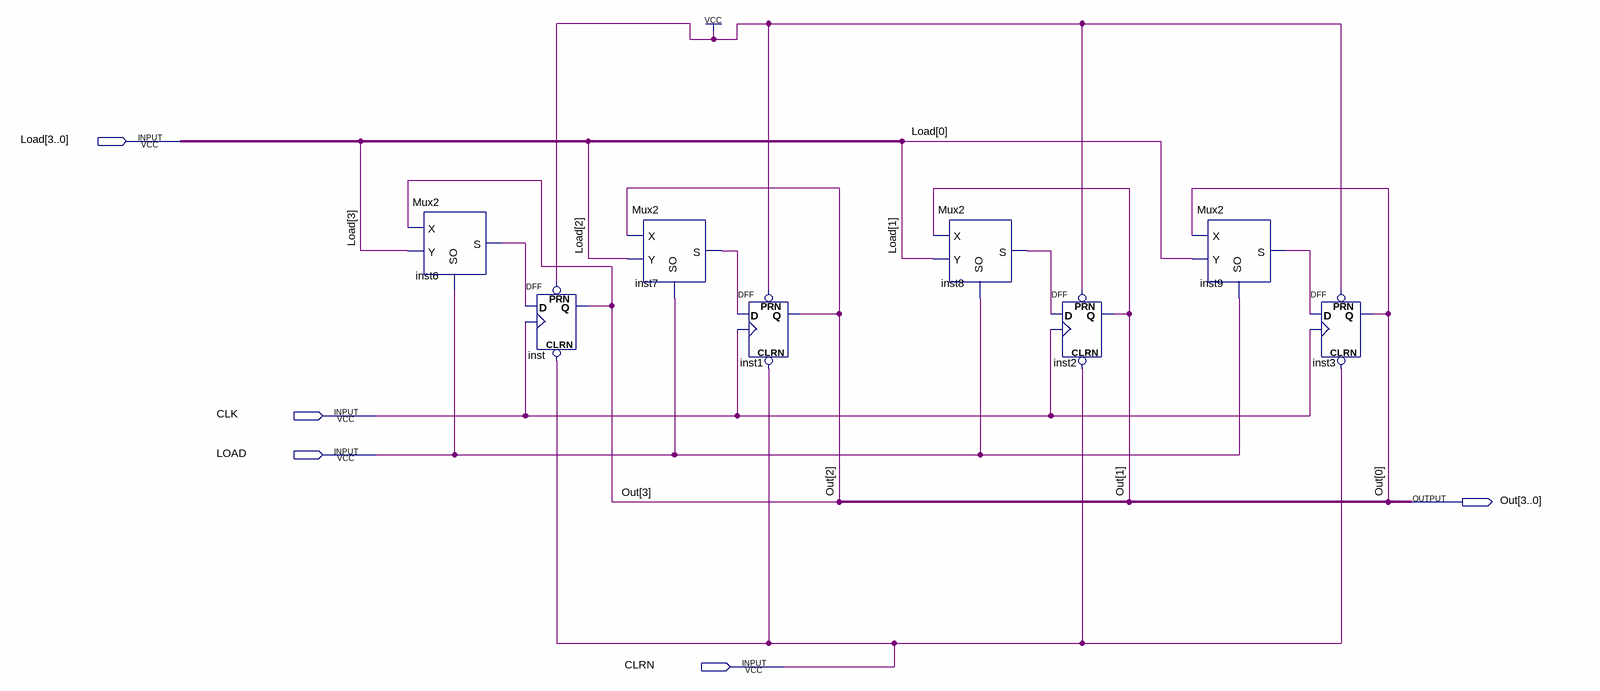
[diagram p0: schematic sheet]
// Quartus schematic Registrador.bdf as structural Verilog: 8 symbols, 5 pins
module Registrador (
  input  [3:0] LOAD,
  input  CLK,
  input  LOAD_1bit,
  input  CLRN,
  output [3:0] Out
);

  wire inst6_s, inst7_s, inst8_s, inst9_s;

  Mux2 inst6 (.X(Out[3]), .SO(LOAD_1bit), .Y(LOAD[3]), .S(inst6_s));
  DFF inst (.CLRN(CLRN), .CLK(CLK), .D(inst6_s), .PRN(1'b1), .Q(Out[3]));
  Mux2 inst7 (.X(Out[2]), .SO(LOAD_1bit), .Y(LOAD[2]), .S(inst7_s));
  DFF inst1 (.CLRN(CLRN), .CLK(CLK), .D(inst7_s), .PRN(1'b1), .Q(Out[2]));
  Mux2 inst8 (.X(Out[1]), .SO(LOAD_1bit), .Y(LOAD[1]), .S(inst8_s));
  DFF inst2 (.CLRN(CLRN), .CLK(CLK), .D(inst8_s), .PRN(1'b1), .Q(Out[1]));
  Mux2 inst9 (.X(Out[0]), .SO(LOAD_1bit), .Y(LOAD[0]), .S(inst9_s));
  DFF inst3 (.CLRN(CLRN), .CLK(CLK), .D(inst9_s), .PRN(1'b1), .Q(Out[0]));
endmodule
